# Altium schematic sheet 01_MCU.SchDoc
size A4; SheetNumber: 2; SheetTotal: 5
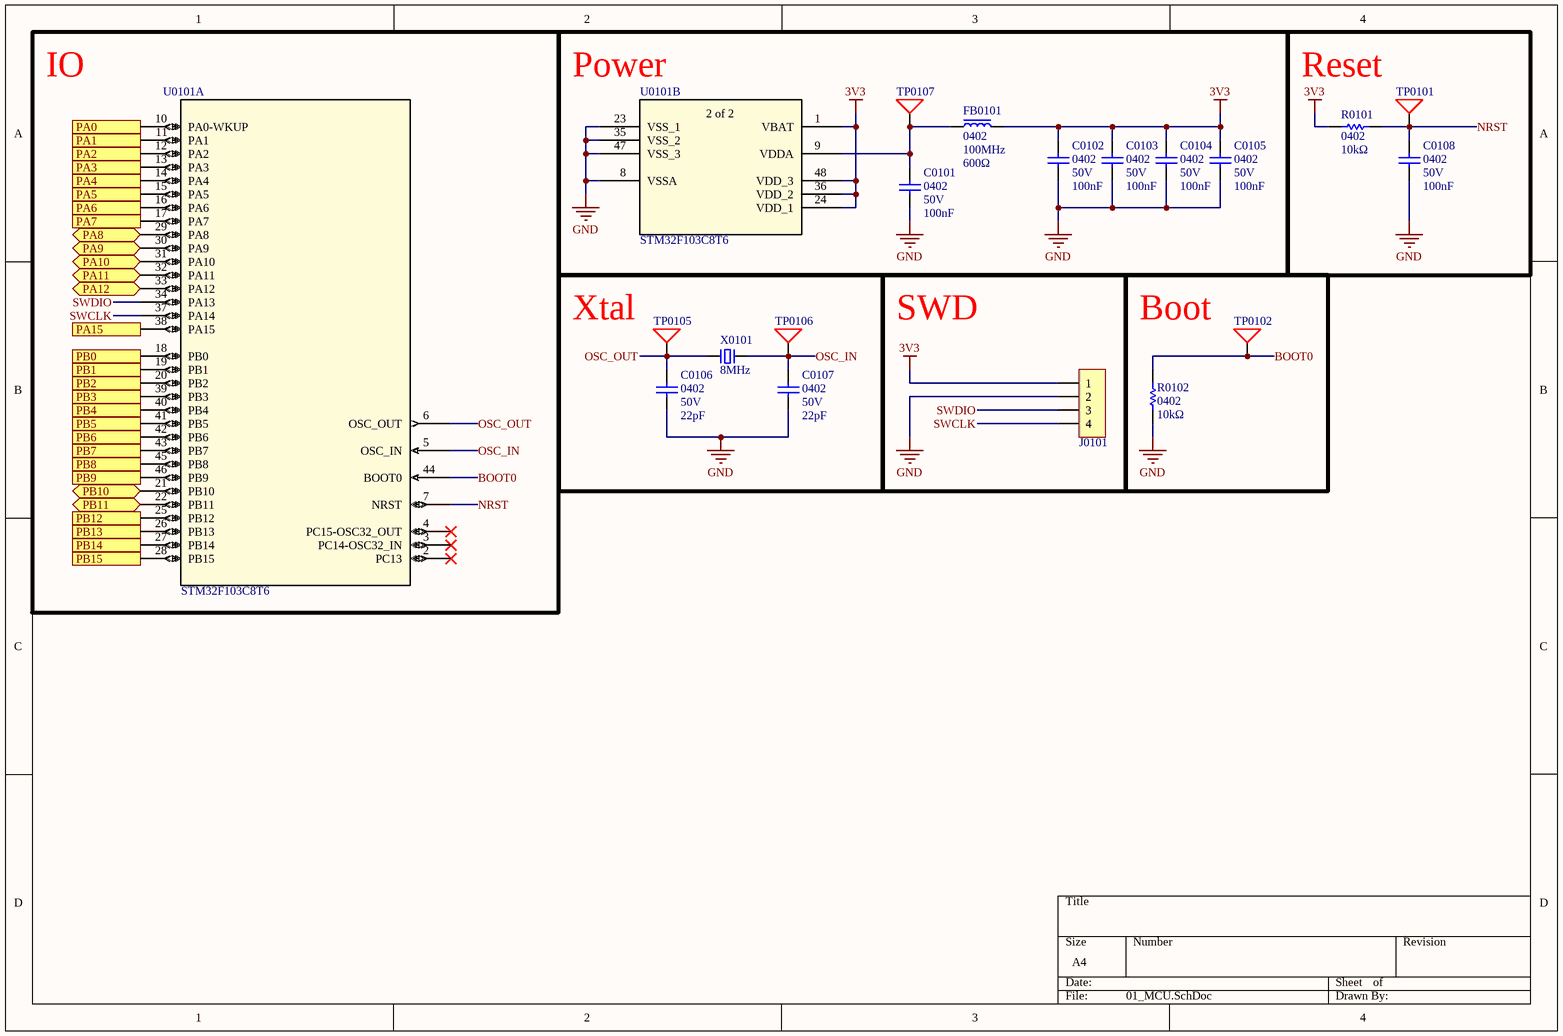
[diagram p0: 01_MCU.SchDoc]

## Parts
C0101  Size: 0402  Volt: 50V  Cap: 100nF  [C0402]  (hidden comment: Cap)
C0102  Size: 0402  Volt: 50V  Cap: 100nF  [C0402]  (hidden comment: Cap)
C0103  Size: 0402  Volt: 50V  Cap: 100nF  [C0402]  (hidden comment: Cap)
C0104  Size: 0402  Volt: 50V  Cap: 100nF  [C0402]  (hidden comment: Cap)
C0105  Size: 0402  Volt: 50V  Cap: 100nF  [C0402]  (hidden comment: Cap)
C0106  Size: 0402  Volt: 50V  Cap: 22pF  [C0402]  (hidden comment: Cap)
C0107  Size: 0402  Volt: 50V  Cap: 22pF  [C0402]  (hidden comment: Cap)
C0108  Size: 0402  Volt: 50V  Cap: 100nF  [C0402]  (hidden comment: Cap)
FB0101  Size: 0402  Freq: 100MHz  Res: 600Ω  [FB 0402]  (hidden comment: FB)
J0101  HDR-1X4  [XH2.54-4P]  (value not drawn)
R0101  Size: 0402  Res: 10kΩ  [R0402]  (hidden comment: RES)
R0102  Size: 0402  Res: 10kΩ  [R0402]  (hidden comment: RES)
TP0101  Test Point  [Test Point]  (value not drawn)
TP0102  Test Point  [Test Point]  (value not drawn)
TP0105  Test Point  [Test Point]  (value not drawn)
TP0106  Test Point  [Test Point]  (value not drawn)
TP0107  Test Point  [Test Point]  (value not drawn)
U0101  STM32F103C8T6  [LQFP48_STM-M]  (parts A,B of 2)
X0101  8MHz  [XTAL-2P 5032]

## Blocks framed on the sheet
IO: U0101
Power: C0101 C0102 C0103 C0104 C0105 FB0101 TP0107 U0101
Reset: C0108 R0101 TP0101
Xtal: C0106 C0107 TP0105 TP0106 X0101
SWD: J0101
Boot: R0102 TP0102

## Ports
PA0 (see 00_McuComBrd[1A]), PA1 (see 00_McuComBrd[1A]), PA2 (see 00_McuComBrd[1A]), PA3 (see 00_McuComBrd[1A]), PA4 (see 00_McuComBrd[1A]), PA5 (see 00_McuComBrd[1A]), PA6 (see 00_McuComBrd[1A]), PA7 (see 00_McuComBrd[1A]), PA8 (bidir, see 00_McuComBrd[1A]), PA9 (bidir, see 00_McuComBrd[1B]), PA10 (bidir, see 00_McuComBrd[1B]), PA11 (bidir, see 00_McuComBrd[1B]), PA12 (bidir, see 00_McuComBrd[1B]), PA15 (see 00_McuComBrd[1B]), PB0 (see 00_McuComBrd[1A]), PB1 (see 00_McuComBrd[1A]), PB2 (see 00_McuComBrd[1A]), PB3 (see 00_McuComBrd[1A]), PB4 (see 00_McuComBrd[1A]), PB5 (see 00_McuComBrd[1A]), PB6 (see 00_McuComBrd[1A]), PB7 (see 00_McuComBrd[1A]), PB8 (see 00_McuComBrd[1A]), PB9 (see 00_McuComBrd[1B]), PB10 (bidir, see 00_McuComBrd[1B]), PB11 (bidir, see 00_McuComBrd[1B]), PB12 (see 00_McuComBrd[1B]), PB13 (see 00_McuComBrd[1B]), PB14 (see 00_McuComBrd[1B]), PB15 (see 00_McuComBrd[1B])

## Nets
3V3: C0102.2 C0103.2 C0104.2 C0105.2 FB0101.2 J0101.1 R0101.1 U0101.1(VBAT) U0101.24(VDD_1) U0101.36(VDD_2) U0101.48(VDD_3)
GND: C0101.1 C0102.1 C0103.1 C0104.1 C0105.1 C0106.1 C0107.1 C0108.1 J0101.2 R0102.1 U0101.8(VSSA) U0101.23(VSS_1) U0101.35(VSS_2) U0101.47(VSS_3)
BOOT0: R0102.2 TP0102.1 U0101.44(BOOT0)
NRST: C0108.2 R0101.2 TP0101.1 U0101.7(NRST)
OSC_IN: C0107.2 TP0106.1 U0101.5(OSC_IN) X0101.2
OSC_OUT: C0106.2 TP0105.1 U0101.6(OSC_OUT) X0101.1
PA0: U0101.10(PA0-WKUP) ; port PA0
PA1: U0101.11(PA1) ; port PA1
PA2: U0101.12(PA2) ; port PA2
PA3: U0101.13(PA3) ; port PA3
PA4: U0101.14(PA4) ; port PA4
PA5: U0101.15(PA5) ; port PA5
PA6: U0101.16(PA6) ; port PA6
PA7: U0101.17(PA7) ; port PA7
PA8: U0101.29(PA8) ; port PA8
PA9: U0101.30(PA9) ; port PA9
PA10: U0101.31(PA10) ; port PA10
PA11: U0101.32(PA11) ; port PA11
PA12: U0101.33(PA12) ; port PA12
PA15: U0101.38(PA15) ; port PA15
PB0: U0101.18(PB0) ; port PB0
PB1: U0101.19(PB1) ; port PB1
PB2: U0101.20(PB2) ; port PB2
PB3: U0101.39(PB3) ; port PB3
PB4: U0101.40(PB4) ; port PB4
PB5: U0101.41(PB5) ; port PB5
PB6: U0101.42(PB6) ; port PB6
PB7: U0101.43(PB7) ; port PB7
PB8: U0101.45(PB8) ; port PB8
PB9: U0101.46(PB9) ; port PB9
PB10: U0101.21(PB10) ; port PB10
PB11: U0101.22(PB11) ; port PB11
PB12: U0101.25(PB12) ; port PB12
PB13: U0101.26(PB13) ; port PB13
PB14: U0101.27(PB14) ; port PB14
PB15: U0101.28(PB15) ; port PB15
SWCLK: J0101.4 U0101.37(PA14)
SWDIO: J0101.3 U0101.34(PA13)
NetC0101_2: C0101.2 FB0101.1 TP0107.1 U0101.9(VDDA)

Not connected (* = marked no-connect by the designer): U0101 2(PC13)* 3(PC14-OSC32_IN)* 4(PC15-OSC32_OUT)*

## Notes on the sheet
- (in symbol STM32F103C8T6, part B) 2 of 2

## Library data of the parts
FB0101 = FB: 磁珠; Current: 1A
J0101 = Header 4P: 4P接插件; 版权归属: 源创客; BOM名称: 4P接插件; 学习资源: www.ooocke.com
R0101 R0102 = RES: 电阻; Current: 1A
U0101 = STM32F103C8T6: No Description Available; Mfr_Name: STMicroelectronics; RefDes: RefDes; Type: Type
X0101 = XTAL-2: 2脚晶振; 版权归属: 源创客; BOM名称: 2脚晶振; 学习资源: www.ooocke.com